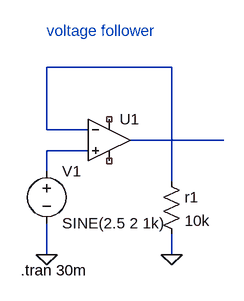
[diagram p0: schematic voltage follower.asc]
voltage follower.asc, the LTspice schematic file:
Version 4.1
SHEET 1 880 680
WIRE 304 48 112 48
WIRE 112 144 112 48
WIRE 176 144 112 144
WIRE 384 160 240 160
WIRE 176 176 112 176
WIRE 112 208 112 176
WIRE 304 224 304 48
WIRE 112 336 112 288
WIRE 304 336 304 304
FLAG 112 336 0
FLAG 304 336 0
SYMBOL res 288 208 R0
SYMATTR InstName r1
SYMATTR Value 10k
SYMBOL voltage 112 192 R0
WINDOW 123 0 0 Left 0
WINDOW 39 0 0 Left 0
SYMATTR InstName V1
SYMATTR Value SINE(2.5 2 1k)
SYMBOL OpAmps\\UniversalOpAmp2 208 160 R0
SYMATTR InstName U1
TEXT 72 360 Left 2 !.tran 30m
TEXT 112 -8 Left 2 ;voltage follower

The netlist it stands for:
* voltage follower.asc
r1 N001 0 10k
V1 N003 0 SINE(2.5 2 1k)
X§U1 N003 N001 NC_01 NC_02 N002 level2 Avol=1Meg GBW=10Meg Slew=10Meg Ilimit=25m Rail=0 Vos=0 En=0 Enk=0 In=0 Ink=0 Rin=500Meg  ; pins In+ In- V+ V- OUT
.tran 30m
* voltage follower
.lib UniversalOpAmp2.lib
.backanno
.end